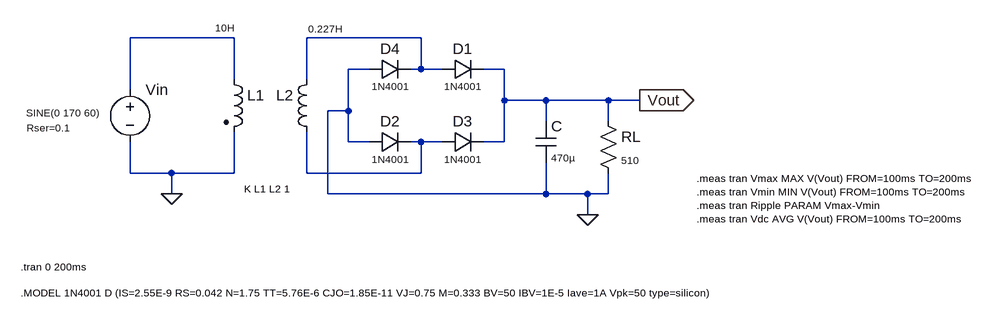
[diagram p0: schematic full_wave_rectifier.asc]
full_wave_rectifier.asc, the LTspice schematic file:
Version 4.1
SHEET 1 1360 1012
WIRE 128 16 -32 16
WIRE 416 16 240 16
WIRE 336 64 304 64
WIRE 416 64 416 16
WIRE 416 64 400 64
WIRE 448 64 416 64
WIRE 544 64 512 64
WIRE 128 80 128 16
WIRE 240 80 240 16
WIRE -32 96 -32 16
WIRE 544 112 544 64
WIRE 608 112 544 112
WIRE 704 112 608 112
WIRE 752 112 704 112
WIRE 304 128 304 64
WIRE 304 128 272 128
WIRE 608 144 608 112
WIRE 704 144 704 112
WIRE 304 176 304 128
WIRE 336 176 304 176
WIRE 416 176 400 176
WIRE 448 176 416 176
WIRE 544 176 544 112
WIRE 544 176 512 176
WIRE -32 224 -32 176
WIRE 32 224 -32 224
WIRE 128 224 128 160
WIRE 128 224 32 224
WIRE 240 224 240 160
WIRE 416 224 416 176
WIRE 416 224 240 224
WIRE 32 256 32 224
WIRE 272 256 272 128
WIRE 608 256 608 208
WIRE 608 256 272 256
WIRE 672 256 608 256
WIRE 704 256 704 224
WIRE 704 256 672 256
WIRE 672 288 672 256
FLAG 672 288 0
FLAG 32 256 0
FLAG 752 112 Vout
IOPIN 752 112 Out
SYMBOL voltage -32 80 R0
WINDOW 3 -160 51 Left 1
WINDOW 123 0 0 Left 0
WINDOW 39 -159 74 Left 1
SYMATTR Value SINE(0 170 60)
SYMATTR SpiceLine Rser=0.1
SYMATTR InstName Vin
SYMBOL ind2 112 64 R0
WINDOW 3 -13 -64 Left 1
SYMATTR Value 10H
SYMATTR InstName L1
SYMATTR Type ind
SYMBOL diode 336 80 R270
WINDOW 0 32 32 VTop 2
WINDOW 3 0 32 VBottom 1
SYMATTR InstName D4
SYMATTR Value 1N4001
SYMBOL diode 448 80 R270
WINDOW 0 32 32 VTop 2
WINDOW 3 0 32 VBottom 1
SYMATTR InstName D1
SYMATTR Value 1N4001
SYMBOL diode 336 192 R270
WINDOW 0 32 32 VTop 2
WINDOW 3 0 32 VBottom 1
SYMATTR InstName D2
SYMATTR Value 1N4001
SYMBOL diode 448 192 R270
WINDOW 0 32 32 VTop 2
WINDOW 3 0 32 VBottom 1
SYMATTR InstName D3
SYMATTR Value 1N4001
SYMBOL res 688 128 R0
WINDOW 3 36 76 Left 1
SYMATTR Value 510
SYMATTR InstName RL
SYMBOL cap 592 144 R0
WINDOW 3 24 56 Left 1
SYMATTR Value 470µ
SYMATTR InstName C
SYMBOL ind 256 64 M0
WINDOW 3 -38 -62 Left 1
SYMATTR Value 0.227H
SYMATTR InstName L2
SYMATTR Type ind
TEXT 144 248 Left 1 !K L1 L2 1
TEXT -200 368 Left 1 !.tran 0 200ms
TEXT -200 408 Left 1 !.MODEL 1N4001 D (IS=2.55E-9 RS=0.042 N=1.75 TT=5.76E-6 CJO=1.85E-11 VJ=0.75 M=0.333 BV=50 IBV=1E-5 Iave=1A Vpk=50 type=silicon)
TEXT 840 232 Left 1 !.meas tran Vmax MAX V(Vout) FROM=100ms TO=200ms\n.meas tran Vmin MIN V(Vout) FROM=100ms TO=200ms\n.meas tran Ripple PARAM Vmax-Vmin\n.meas tran Vdc AVG V(Vout) FROM=100ms TO=200ms

The netlist it stands for:
* full_wave_rectifier.asc
Vin N001 0 SINE(0 170 60) Rser=0.1
L1 N001 0 10H
D4 0 N002 1N4001
D1 N002 Vout 1N4001
D2 0 N003 1N4001
D3 N003 Vout 1N4001
RL Vout 0 510
C Vout 0 470µ
L2 N002 N003 0.227H
.model D D
.lib standard.dio
K L1 L2 1
.tran 0 200ms
.MODEL 1N4001 D (IS=2.55E-9 RS=0.042 N=1.75 TT=5.76E-6 CJO=1.85E-11 VJ=0.75 M=0.333 BV=50 IBV=1E-5 Iave=1A Vpk=50 type=silicon)
.meas tran Vmax MAX V(Vout) FROM=100ms TO=200ms
.meas tran Vmin MIN V(Vout) FROM=100ms TO=200ms
.meas tran Ripple PARAM Vmax-Vmin
.meas tran Vdc AVG V(Vout) FROM=100ms TO=200ms
.backanno
.end